# Altium schematic sheet Audio.SchDoc
size A4; Organization: Altium Limited; Address1: L3, 12a Rodborough Rd; Address2: Frenchs Forest; Address3: NSW; Address4: Australia 2086
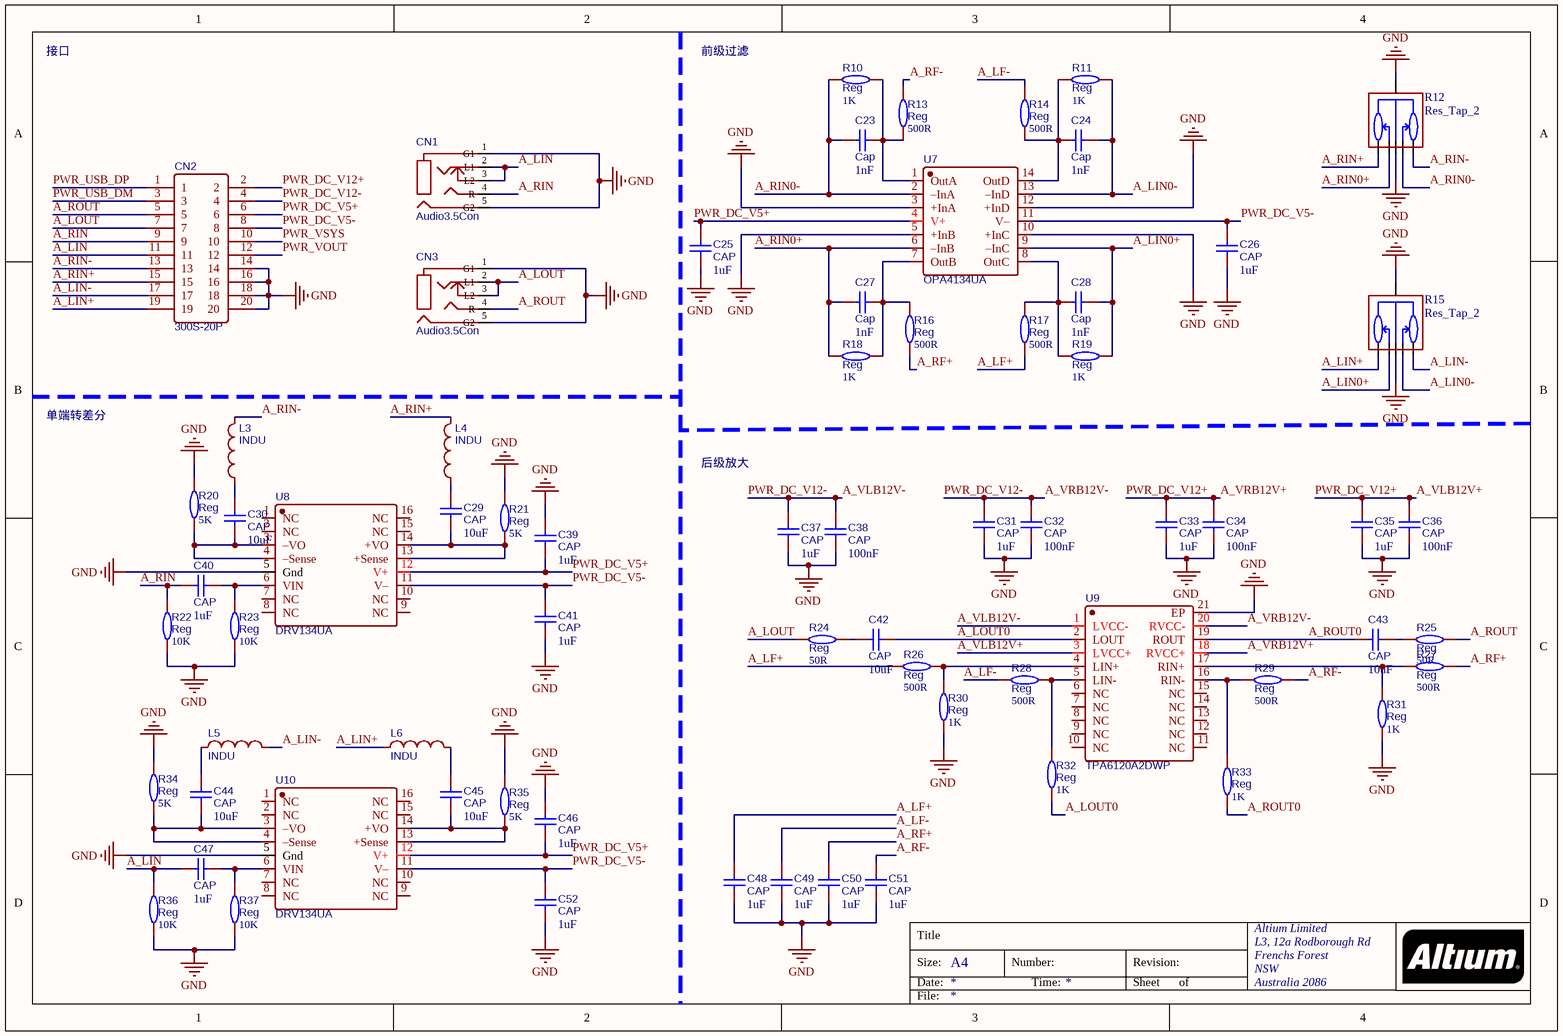
[diagram p0: Audio.SchDoc]

## Parts
C23  Cap  value 1nF  [C0603]
C24  Cap  value 1nF  [C0603]
C25  CAP  value 1uF  [C0603]
C26  CAP  value 1uF  [C0603]
C27  Cap  value 1nF  [C0603]
C28  Cap  value 1nF  [C0603]
C29  CAP  value 10uF  [C0603]
C30  CAP  value 10uF  [C0603]
C31  CAP  value 1uF  [C0603]
C32  CAP  value 100nF  [C0603]
C33  CAP  value 1uF  [C0603]
C34  CAP  value 100nF  [C0603]
C35  CAP  value 1uF  [C0603]
C36  CAP  value 100nF  [C0603]
C37  CAP  value 1uF  [C0603]
C38  CAP  value 100nF  [C0603]
C39  CAP  value 1uF  [C0603]
C40  CAP  value 1uF  [C0603]
C41  CAP  value 1uF  [C0603]
C42  CAP  value 10uF  [C0603]
C43  CAP  value 10uF  [C0603]
C44  CAP  value 10uF  [C0603]
C45  CAP  value 10uF  [C0603]
C46  CAP  value 1uF  [C0603]
C47  CAP  value 1uF  [C0603]
C48  CAP  value 1uF  [C0603]
C49  CAP  value 1uF  [C0603]
C50  CAP  value 1uF  [C0603]
C51  CAP  value 1uF  [C0603]
C52  CAP  value 1uF  [C0603]
CN1  Audio3.5Con  [Audio3.5_3Pin]
CN2  300S-20P  [DC_20P_2.54]
CN3  Audio3.5Con  [Audio3.5_3Pin]
L3  INDU  [L1210]
L4  INDU  [L1210]
L5  INDU  [L1210]
L6  INDU  [L1210]
R10  Reg  value 1K  [R0603]
R11  Reg  value 1K  [R0603]
R12  Res_Tap_2  [RES_TAP_5Pin]
R13  Reg  value 500R  [R0603]
R14  Reg  value 500R  [R0603]
R15  Res_Tap_2  [RES_TAP_5Pin]
R16  Reg  value 500R  [R0603]
R17  Reg  value 500R  [R0603]
R18  Reg  value 1K  [R0603]
R19  Reg  value 1K  [R0603]
R20  Reg  value 5K  [R0603]
R21  Reg  value 5K  [R0603]
R22  Reg  value 10K  [R0603]
R23  Reg  value 10K  [R0603]
R24  Reg  value 50R  [R0603]
R25  Reg  value 50R  [R0603]
R26  Reg  value 500R  [R0603]
R27  Reg  value 500R  [R0603]
R28  Reg  value 500R  [R0603]
R29  Reg  value 500R  [R0603]
R30  Reg  value 1K  [R0603]
R31  Reg  value 1K  [R0603]
R32  Reg  value 1K  [R0603]
R33  Reg  value 1K  [R0603]
R34  Reg  value 5K  [R0603]
R35  Reg  value 5K  [R0603]
R36  Reg  value 10K  [R0603]
R37  Reg  value 10K  [R0603]
U7  OPA4134UA  [SOIC-14]
U8  DRV134UA  [SOIC-16_9.5mm]
U9  TPA6120A2DWP  [HSOP-20]
U10  DRV134UA  [SOIC-16_9.5mm]

## Nets
GND: C25.1 C26.1 C31.1 C32.1 C33.1 C34.1 C35.1 C36.1 C37.1 C38.1 C39.2 C41.1 C46.2 C48.2 C49.2 C50.2 C51.2 C52.1 CN1.1(G1) CN1.5(G2) CN2.14 CN2.16 CN2.18 CN2.20 CN3.1(G1) CN3.5(G2) R12.1(G) R12.6(PAD) R15.1(G) R15.6(PAD) R20.2 R21.1 R22.1 R23.1 R30.1 R31.1 R34.2 R35.1 R36.1 R37.1 U7.3(+InA) U7.5(+InB) U7.10(+InC) U7.12(+InD) U8.5(Gnd) U9.21(EP) U10.5(Gnd)
A_LF+: C48.1 R17.1 R26.1
A_LF-: C49.1 R14.2 R28.1
A_LIN: C47.1 CN1.2(L1) CN1.3(L2) CN2.11 R36.2
A_LIN0+: C28.2 R15.3(CH2A) R19.2 U7.9(–InC)
A_LIN0-: C24.2 R11.2 R15.2(CH1A) U7.13(–InD)
A_LIN+: CN2.19 L6.1 R15.4(CH2B)
A_LIN-: CN2.17 L5.2 R15.5(CH1B)
A_LOUT: CN2.7 CN3.2(L1) CN3.3(L2) R24.1
A_LOUT0: C42.1 R32.1 U9.2(LOUT)
A_RF+: C50.1 R16.1 R27.1
A_RF-: C51.1 R13.2 R29.1
A_RIN: C40.1 CN1.4(R) CN2.9 R22.2
A_RIN0+: C27.1 R12.3(CH2A) R18.1 U7.6(–InB)
A_RIN0-: C23.1 R10.1 R12.2(CH1A) U7.2(–InA)
A_RIN+: CN2.15 L4.2 R12.4(CH2B)
A_RIN-: CN2.13 L3.2 R12.5(CH1B)
A_ROUT: CN2.5 CN3.4(R) R25.2
A_ROUT0: C43.2 R33.1 U9.19(ROUT)
A_VLB12V+: C33.2 C34.2 C35.2 C36.2 CN2.2 U9.3(LVCC+) U9.18(RVCC+)  [also labelled A_VRB12V+, PWR_DC_V12+]
A_VLB12V-: C31.2 C32.2 C37.2 C38.2 CN2.4 U9.1(LVCC-) U9.20(RVCC-)  [also labelled A_VRB12V-, PWR_DC_V12-]
PWR_DC_V5+: C25.2 C39.1 C46.1 CN2.6 U7.4(V+) U8.12(V+) U10.12(V+)
PWR_DC_V5-: C26.2 C41.2 C52.2 CN2.8 U7.11(V–) U8.11(V–) U10.11(V–)
PWR_USB_DM: CN2.3
PWR_USB_DP: CN2.1
PWR_VOUT: CN2.12
PWR_VSYS: CN2.10
NetC23_2: C23.2 R10.2 R13.1 U7.1(OutA)
NetC24_1: C24.1 R11.1 R14.1 U7.14(OutD)
NetC27_2: C27.2 R16.2 R18.2 U7.7(OutB)
NetC28_1: C28.1 R17.2 R19.1 U7.8(OutC)
NetC29_1: C29.1 R21.2 U8.13(+Sense) U8.14(+VO)
NetC29_2: C29.2 L4.1
NetC30_1: C30.1 R20.1 U8.3(–VO) U8.4(–Sense)
NetC30_2: C30.2 L3.1
NetC40_2: C40.2 R23.2 U8.6(VIN)
NetC42_2: C42.2 R24.2
NetC43_1: C43.1 R25.1
NetC44_1: C44.1 R34.1 U10.3(–VO) U10.4(–Sense)
NetC44_2: C44.2 L5.1
NetC45_1: C45.1 R35.2 U10.13(+Sense) U10.14(+VO)
NetC45_2: C45.2 L6.2
NetC47_2: C47.2 R37.2 U10.6(VIN)
NetR26_2: R26.2 R30.2 U9.4(LIN+)
NetR27_2: R27.2 R31.2 U9.17(RIN+)
NetR28_2: R28.2 R32.2 U9.5(LIN-)
NetR29_2: R29.2 R33.2 U9.16(RIN-)

Not connected (* = marked no-connect by the designer): U8 1(NC) 2(NC) 7(NC) 8(NC) 9(NC) 10(NC) 15(NC) 16(NC); U9 6(NC) 7(NC) 8(NC) 9(NC) 10(NC) 11(NC) 12(NC) 13(NC) 14(NC) 15(NC); U10 1(NC) 2(NC) 7(NC) 8(NC) 9(NC) 10(NC) 15(NC) 16(NC)

## Notes on the sheet
- 接口
- 前级过滤
- 单端转差分
- 后级放大
- Title
- Size:
- Date:
- A4
- Number:
- Time:
- Revision:
- Sheet
- of
- File:

## Library data of the parts
C23-C52 = CAP: BOM_Manufacturer: Huaxin S&T; BOM_Manufacturer Part: 0603B103K101CT; nameAlias: Capacitance; Contributor: LCSC; BOM_Supplier: LCSC; BOM_Supplier Part: C302008; spicePre: C; spiceSymbolName: 0603B103K101CT
CN1 CN3 = AudioCon3: 3.5mm 3Pin 音频接口; BOM_Manufacturer: G-Switch(品赞); BOM_Manufacturer Part: PJ-393; Contributor: LCSC; BOM_Supplier: LCSC; BOM_Supplier Part: C2837065; BOM_JLCPCB Part Class: Extended Part; spicePre: C; spiceSymbolName: PJ-393_C2837065
CN2 = DC-20P: DC牛角座，20P; BOM_Manufacturer: Shenzhen Cankemeng; Contributor: LCSC; BOM_Supplier: LCSC; BOM_Supplier Part: C132442; BOM_Manufacturer Part: -; BOM_JLCPCB Part Class: Extended Part; spicePre: C; spiceSymbolName: 300S-20P
L3-L6 = IND: 电感; BOM_Manufacturer: Sunltech Tech; BOM_Manufacturer Part: SLO0630H150MTT; nameAlias: Inductance; Contributor: LCSC; BOM_Supplier: LCSC; BOM_Supplier Part: C182182; BOM_JLCPCB Part Class: Extended Part; spicePre: L; spiceSymbolName: SLO0630H150MTT; Value: *
R10 R11 R13 R14 R16-R37 = Res: 电阻; BOM_Manufacturer: Viking Tech; BOM_Manufacturer Part: AR03BTCX1002A; nameAlias: Resistance (Ohms); Contributor: LCSC; BOM_Supplier: LCSC; BOM_Supplier Part: C465721; spicePre: R; spiceSymbolName: AR03BTCX1002A
R12 R15 = Res_Tap_2: 双联电位器
U7 = OPA4134UA: 耳放; BOM_Manufacturer: TI(德州仪器); Contributor: LCSC; BOM_Supplier: LCSC; BOM_Supplier Part: C2832240; BOM_Manufacturer Part: OPA4134UA; BOM_JLCPCB Part Class: Extended Part; spicePre: U; spiceSymbolName: OPA4134UA
U8 U10 = DRV134UA: 音频差分放大器; BOM_Manufacturer: TI(德州仪器); Contributor: LCSC; BOM_Supplier: LCSC; BOM_Supplier Part: C1519988; BOM_Manufacturer Part: DRV134UA; BOM_JLCPCB Part Class: Extended Part; spicePre: U; spiceSymbolName: DRV134UA
U9 = TPA6120: 耳放; BOM_Manufacturer: TI(德州仪器); Contributor: LCSC; BOM_Supplier: LCSC; BOM_Supplier Part: C2871054; BOM_Manufacturer Part: TPA6120A2DWP; link: https://atta.szlcsc.comnull; spicePre: U; spiceSymbolName: TPA6120A2DWP